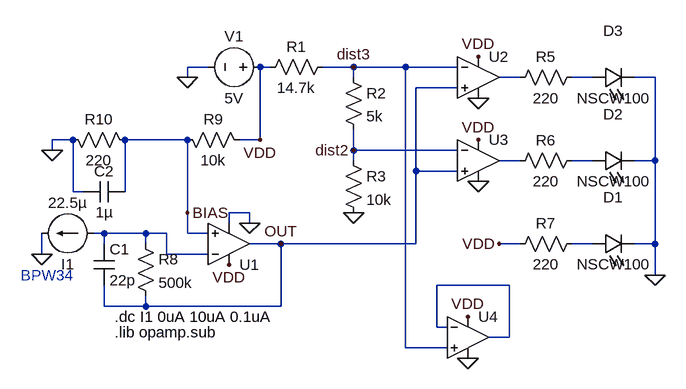
[diagram p0: schematic analog-scheme-real.asc]
analog-scheme-real.asc, the LTspice schematic file:
Version 4.1
SHEET 1 1024 848
WIRE -48 224 -80 224
WIRE 48 224 32 224
WIRE 176 224 128 224
WIRE 256 224 176 224
WIRE 336 224 256 224
WIRE -80 240 -80 224
WIRE 176 240 176 224
WIRE 432 240 400 240
WIRE 544 240 512 240
WIRE 640 240 608 240
WIRE 336 256 272 256
WIRE -256 336 -288 336
WIRE -80 336 -176 336
WIRE 32 336 32 224
WIRE 32 336 0 336
WIRE -288 352 -288 336
WIRE 176 352 176 320
WIRE 336 352 176 352
WIRE 176 368 176 352
WIRE 432 368 400 368
WIRE 544 368 512 368
WIRE 640 368 640 240
WIRE 640 368 608 368
WIRE 272 384 272 256
WIRE 336 384 272 384
WIRE -256 416 -256 336
WIRE -240 416 -256 416
WIRE -176 416 -176 336
WIRE -80 448 -80 336
WIRE 16 448 -16 448
WIRE -16 464 -16 448
WIRE 16 464 16 448
WIRE -208 480 -224 480
WIRE -144 480 -208 480
WIRE -112 480 -144 480
WIRE -80 480 -80 448
WIRE -48 480 -80 480
WIRE -208 496 -208 480
WIRE -144 496 -144 480
WIRE 64 496 16 496
WIRE 272 496 272 384
WIRE 272 496 64 496
WIRE 432 496 400 496
WIRE 544 496 512 496
WIRE 640 496 640 368
WIRE 640 496 608 496
WIRE -304 512 -304 480
WIRE -112 512 -112 480
WIRE -48 512 -112 512
WIRE 640 544 640 496
WIRE 416 560 304 560
WIRE -208 592 -208 560
WIRE -144 592 -144 576
WIRE -144 592 -208 592
WIRE 64 592 64 496
WIRE 64 592 -144 592
WIRE 304 624 304 560
WIRE 320 624 304 624
WIRE 416 640 416 560
WIRE 416 640 384 640
WIRE 256 656 256 224
WIRE 320 656 256 656
FLAG 16 464 0
FLAG -80 240 0
FLAG -304 512 0
FLAG 176 448 0
FLAG 640 544 0
FLAG 368 272 0
FLAG 368 400 0
FLAG -16 528 VDD
FLAG 368 208 VDD
FLAG 368 336 VDD
FLAG 400 496 VDD
FLAG -288 352 0
FLAG 64 496 OUT
FLAG -80 448 BIAS
FLAG 176 224 dist3
FLAG 176 352 dist2
FLAG 32 336 VDD
FLAG 352 608 VDD
FLAG 352 672 0
SYMBOL voltage 48 224 R90
WINDOW 0 -32 56 VBottom 2
WINDOW 3 32 56 VTop 2
SYMATTR InstName V1
SYMATTR Value 5V
SYMBOL current -224 480 M270
WINDOW 0 -32 40 VBottom 2
WINDOW 3 32 40 VTop 2
WINDOW 123 0 0 Left 0
WINDOW 39 0 0 Left 0
SYMATTR InstName I1
SYMATTR Value 22.5µ
SYMBOL res 144 208 R90
WINDOW 0 0 56 VBottom 2
WINDOW 3 32 56 VTop 2
SYMATTR InstName R1
SYMATTR Value 14.7k
SYMBOL res 160 224 R0
SYMATTR InstName R2
SYMATTR Value 5k
SYMBOL res 160 352 R0
SYMATTR InstName R3
SYMATTR Value 10k
SYMBOL LED 544 512 R270
WINDOW 0 72 32 VTop 2
WINDOW 3 0 32 VBottom 2
SYMATTR InstName D1
SYMATTR Value NSCW100
SYMBOL LED 544 384 R270
WINDOW 0 72 32 VTop 2
WINDOW 3 0 32 VBottom 2
SYMATTR InstName D2
SYMATTR Value NSCW100
SYMBOL LED 544 256 R270
WINDOW 0 72 32 VTop 2
WINDOW 3 0 32 VBottom 2
SYMATTR InstName D3
SYMATTR Value NSCW100
SYMBOL OpAmps\\UniversalOpAmp2 -16 496 M180
SYMATTR InstName U1
SYMBOL OpAmps\\UniversalOpAmp2 368 240 R0
SYMATTR InstName U2
SYMBOL OpAmps\\UniversalOpAmp2 368 368 R0
SYMATTR InstName U3
SYMBOL res 16 352 M270
WINDOW 0 32 56 VTop 2
WINDOW 3 0 56 VBottom 2
SYMATTR InstName R9
SYMATTR Value 10k
SYMBOL res -160 352 M270
WINDOW 0 32 56 VTop 2
WINDOW 3 0 56 VBottom 2
SYMATTR InstName R10
SYMATTR Value 220
SYMBOL cap -240 400 M90
WINDOW 0 0 32 VBottom 2
WINDOW 3 32 32 VTop 2
SYMATTR InstName C2
SYMATTR Value 1µ
SYMBOL res 528 224 R90
WINDOW 0 0 56 VBottom 2
WINDOW 3 32 56 VTop 2
SYMATTR InstName R5
SYMATTR Value 220
SYMBOL res 528 352 R90
WINDOW 0 0 56 VBottom 2
WINDOW 3 32 56 VTop 2
SYMATTR InstName R6
SYMATTR Value 220
SYMBOL res 528 480 R90
WINDOW 0 0 56 VBottom 2
WINDOW 3 32 56 VTop 2
SYMATTR InstName R7
SYMATTR Value 220
SYMBOL res -160 480 R0
SYMATTR InstName R8
SYMATTR Value 500k
SYMBOL cap -224 496 R0
SYMATTR InstName C1
SYMATTR Value 22p
SYMBOL OpAmps\\UniversalOpAmp2 352 640 R0
SYMATTR InstName U4
TEXT -192 608 Left 2 !.dc I1 0uA 10uA 0.1uA
TEXT -192 632 Left 2 !.lib opamp.sub
TEXT -296 544 Center 2 ;BPW34

The netlist it stands for:
* analog-scheme-real.asc
V1 VDD 0 5V
I1 N005 0 22.5µ
R1 dist3 VDD 14.7k
R2 dist3 dist2 5k
R3 dist2 0 10k
D1 N006 0 NSCW100
D2 N004 0 NSCW100
D3 N002 0 NSCW100
X§U1 BIAS N005 VDD 0 OUT level2 Avol=1Meg GBW=10Meg Slew=10Meg Ilimit=25m Rail=0 Vos=0 En=0 Enk=0 In=0 Ink=0 Rin=500Meg  ; pins In+ In- V+ V- OUT
X§U2 OUT dist3 VDD 0 N001 level2 Avol=1Meg GBW=10Meg Slew=10Meg Ilimit=25m Rail=0 Vos=0 En=0 Enk=0 In=0 Ink=0 Rin=500Meg  ; pins In+ In- V+ V- OUT
X§U3 OUT dist2 VDD 0 N003 level2 Avol=1Meg GBW=10Meg Slew=10Meg Ilimit=25m Rail=0 Vos=0 En=0 Enk=0 In=0 Ink=0 Rin=500Meg  ; pins In+ In- V+ V- OUT
R9 VDD BIAS 10k
R10 BIAS 0 220
C2 0 BIAS 1µ
R5 N002 N001 220
R6 N004 N003 220
R7 N006 VDD 220
R8 N005 OUT 500k
C1 N005 OUT 22p
X§U4 dist3 N007 VDD 0 N007 level2 Avol=1Meg GBW=10Meg Slew=10Meg Ilimit=25m Rail=0 Vos=0 En=0 Enk=0 In=0 Ink=0 Rin=500Meg  ; pins In+ In- V+ V- OUT
.model D D
.lib standard.dio
.dc I1 0uA 10uA 0.1uA
.lib opamp.sub
* BPW34
.lib UniversalOpAmp2.lib
.backanno
.end